# Altium schematic sheet A2_relay_v40.SchDoc
size A4
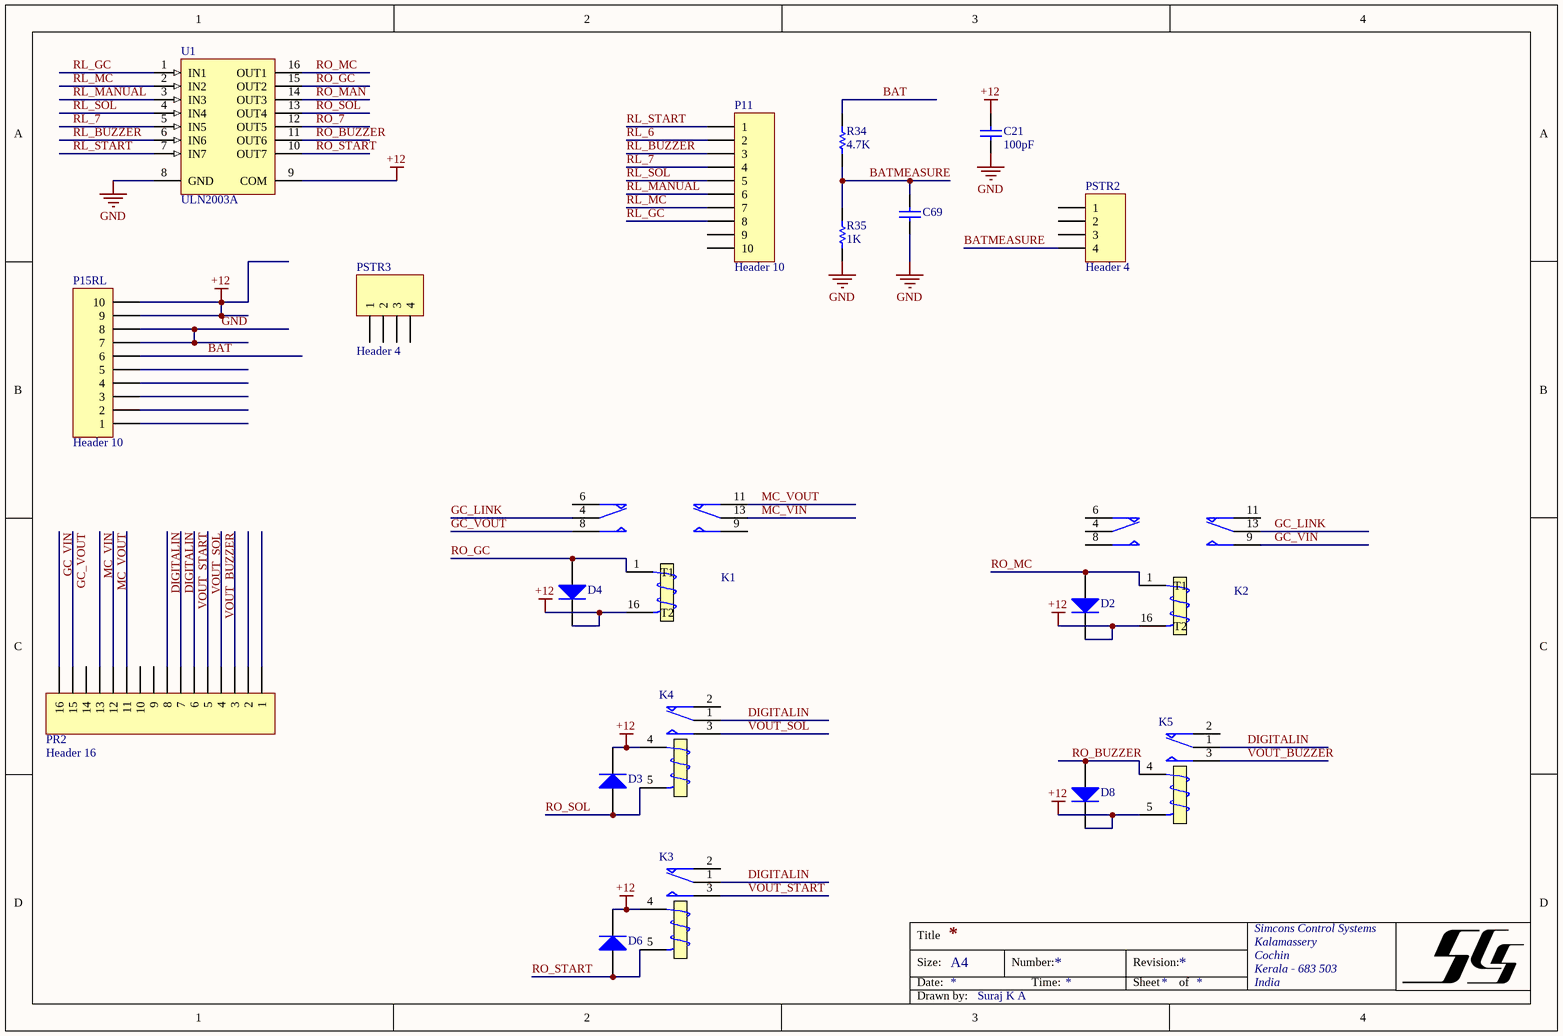
[diagram p0: A2_relay_v40.SchDoc]

## Parts
C21  value 100pF  [CAP DISC .2]  (hidden comment: 1uF 1206)
C69  1uF 1206  [CAP DISC .2]  (value not drawn)
D2  1N4007  [DIODE1A]  (value not drawn)
D3  1N4007  [DIODE1A]  (value not drawn)
D4  1N4007  [DIODE1A]  (value not drawn)
D6  1N4007  [DIODE1A]  (value not drawn)
D8  1N4007  [DIODE1A]  (value not drawn)
K1  46-12-2CE  [RELAYDPDT]  (value not drawn)
K2  46-12-2CE  [RELAYDPDT]  (value not drawn)
K3  61-06-1CE  [RELAY]  (value not drawn)
K4  61-06-1CE  [RELAY]  (value not drawn)
K5  61-06-1CE  [RELAY]  (value not drawn)
P11  Header 10  [HDR1X10_BURGE_M2]
P15RL  Header 10  [HDR1X10_BURGE_M]
PR2  Header 16  [HDR1X16_BURGE_M]
PSTR2  Header 4  [HDR1X4_BURGE_M]
PSTR3  Header 4  [HDR1X4_BURGE_M]
R34  value 4.7K  [AXIAL-0.4]  (hidden comment: 47K 1206)
R35  value 1K  [AXIAL-0.4]  (hidden comment: 4.7K 1206)
U1  ULN2003A  [DIP-16]

## Nets
+12: C21.2 D2.2(K) D3.2(K) D4.2(K) D6.2(K) D8.2(K) K1.16(T2) K2.16(T2) K3.4(T1) K4.4(T1) K5.5(T2) P15RL.9 P15RL.10 U1.9(COM)
GND: C21.1 C69.1 P15RL.7 P15RL.8 R35.1 U1.8(GND)
BAT: P15RL.6 R34.2
BATMEASURE: C69.2 PSTR2.4 R34.1 R35.2
DIGITALIN: K3.1(COM) K4.1(COM) K5.1(COM) PR2.7 PR2.8
GC_LINK: K1.4(COM) K2.13(COM)
GC_VIN: K2.9(NO) PR2.16
GC_VOUT: K1.8(NO) PR2.15
MC_VIN: K1.13(COM) PR2.13
MC_VOUT: K1.11(NC) PR2.12
RL_6: P11.2
RL_7: P11.4 U1.5(IN5)
RL_BUZZER: P11.3 U1.6(IN6)
RL_GC: P11.8 U1.1(IN1)
RL_MANUAL: P11.6 U1.3(IN3)
RL_MC: P11.7 U1.2(IN2)
RL_SOL: P11.5 U1.4(IN4)
RL_START: P11.1 U1.7(IN7)
RO_7: U1.12(OUT5)
RO_BUZZER: D8.1(A) K5.4(T1) U1.11(OUT6)
RO_GC: D4.1(A) K1.1(T1) U1.15(OUT2)
RO_MAN: U1.14(OUT3)
RO_MC: D2.1(A) K2.1(T1) U1.16(OUT1)
RO_SOL: D3.1(A) K4.5(T2) U1.13(OUT4)
RO_START: D6.1(A) K3.5(T2) U1.10(OUT7)
VOUT_BUZZER: K5.3(NO) PR2.4
VOUT_SOL: K4.3(NO) PR2.5
VOUT_START: K3.3(NO) PR2.6

Not connected (* = marked no-connect by the designer): K1 6(NC) 9(NO); K2 4(COM) 6(NC) 8(NO) 11(NC); K3 2(NC); K4 2(NC); K5 2(NC); P11 9 10; P15RL 1 2 3 4 5; PR2 1 2 3 9 10 11 14; PSTR2 1 2 3; PSTR3 1 2 3 4

## Notes on the sheet
- Title
- Size:
- Date:
- A4
- Number:
- Time:
- Revision:
- Sheet
- of
- Simcons Control Systems
- Kalamassery
- Cochin
- Kerala - 683 503
- India
- Drawn by:
- Suraj K A

## Library data of the parts
C21 = Cap: Capacitor; Published: 8-Jun-2000; LatestRevisionDate: 17-Jul-2002; LatestRevisionNote: Re-released for DXP Platform.; PackageReference: RAD-0.3; Publisher: Altium Limited; PackageDescription: Radial Cap, Thru-Hole; 2 Leads; 0.3 in Pin Spacing
C69 = CAP: Capacitor; Value: 100nF; Published: 8-Jun-2000; LatestRevisionDate: 17-Jul-2002; LatestRevisionNote: Re-released for DXP Platform.; PackageReference: RAD-0.3; Publisher: Altium Limited; PackageDescription: Radial Cap, Thru-Hole; 2 Leads; 0.3 in Pin Spacing
D2-D4 D6 D8 = Diode 1N5408: Small Signal Fast Switching Diode; Published: 8-Jun-2000; LatestRevisionDate: 17-Jul-2002; LatestRevisionNote: Re-released for DXP Platform.; DatasheetVersion: Aug-1984; PackageReference: DO-201AD; Publisher: Altium Limited; PackageDescription: Diode, Axial; Body 9.5 x 5.3 mm (LxDia. max), Lead Dia. 1.32 mm (max); ComponentLink1Description: Manufacturer Link; ComponentLink1URL: http://www.irf.com/
K1 K2 = RELAYDPDT: DPDT RELAY
K3-K5 = Relay: SPDT Relay; Published: 8-Jun-2000; LatestRevisionDate: 17-Jul-2002; LatestRevisionNote: Re-released for DXP Platform.; PackageReference: MODULE5B; Publisher: Altium Limited
P11 P15RL = Header 10: Header, 10-Pin; LatestRevisionDate: 17-Jul-2002; LatestRevisionNote: Re-released for DXP Platform.; Publisher: Altium Limited
PR2 = Header 16: Header, 16-Pin; LatestRevisionDate: 17-Jul-2002; LatestRevisionNote: Re-released for DXP Platform.; Publisher: Altium Limited
PSTR2 PSTR3 = Header 4: Header, 4-Pin; LatestRevisionDate: 17-Jul-2002; LatestRevisionNote: Re-released for DXP Platform.; Publisher: Altium Limited
R34 R35 = Res1: Resistor; Published: 8-Jun-2000; LatestRevisionDate: 17-Jul-2002; LatestRevisionNote: Re-released for DXP Platform.; PackageReference: AXIAL-0.3; Publisher: Altium Limited; PackageDescription: Axial Device, Thru-Hole; 2 Leads; 0.3 in Pin Spacing
U1 = ULN2003A: Seven Darlington Array; Published: 8-Jun-2000; LatestRevisionDate: 06-Jun-2005; LatestRevisionNote: Stylized 3D Model Added.; DatasheetVersion: Sep-1998; PackageVersion: Apr-1996; PackageReference: DIP16; Publisher: Altium Limited; PackageDescription: DIP; 16 Leads; Row Spacing 7.62 mm; Pitch 2.54 mm; ComponentLink1Description: Manufacturer Link; ComponentLink1URL: http://www.st.com/; ComponentLink2Description: Datasheet; ComponentLink2URL: http://www.st.com/stonline/products/literature/ds/5279/uln2001.pdf